# Altium schematic sheet 02_Boost_Converter.SchDoc
size A2
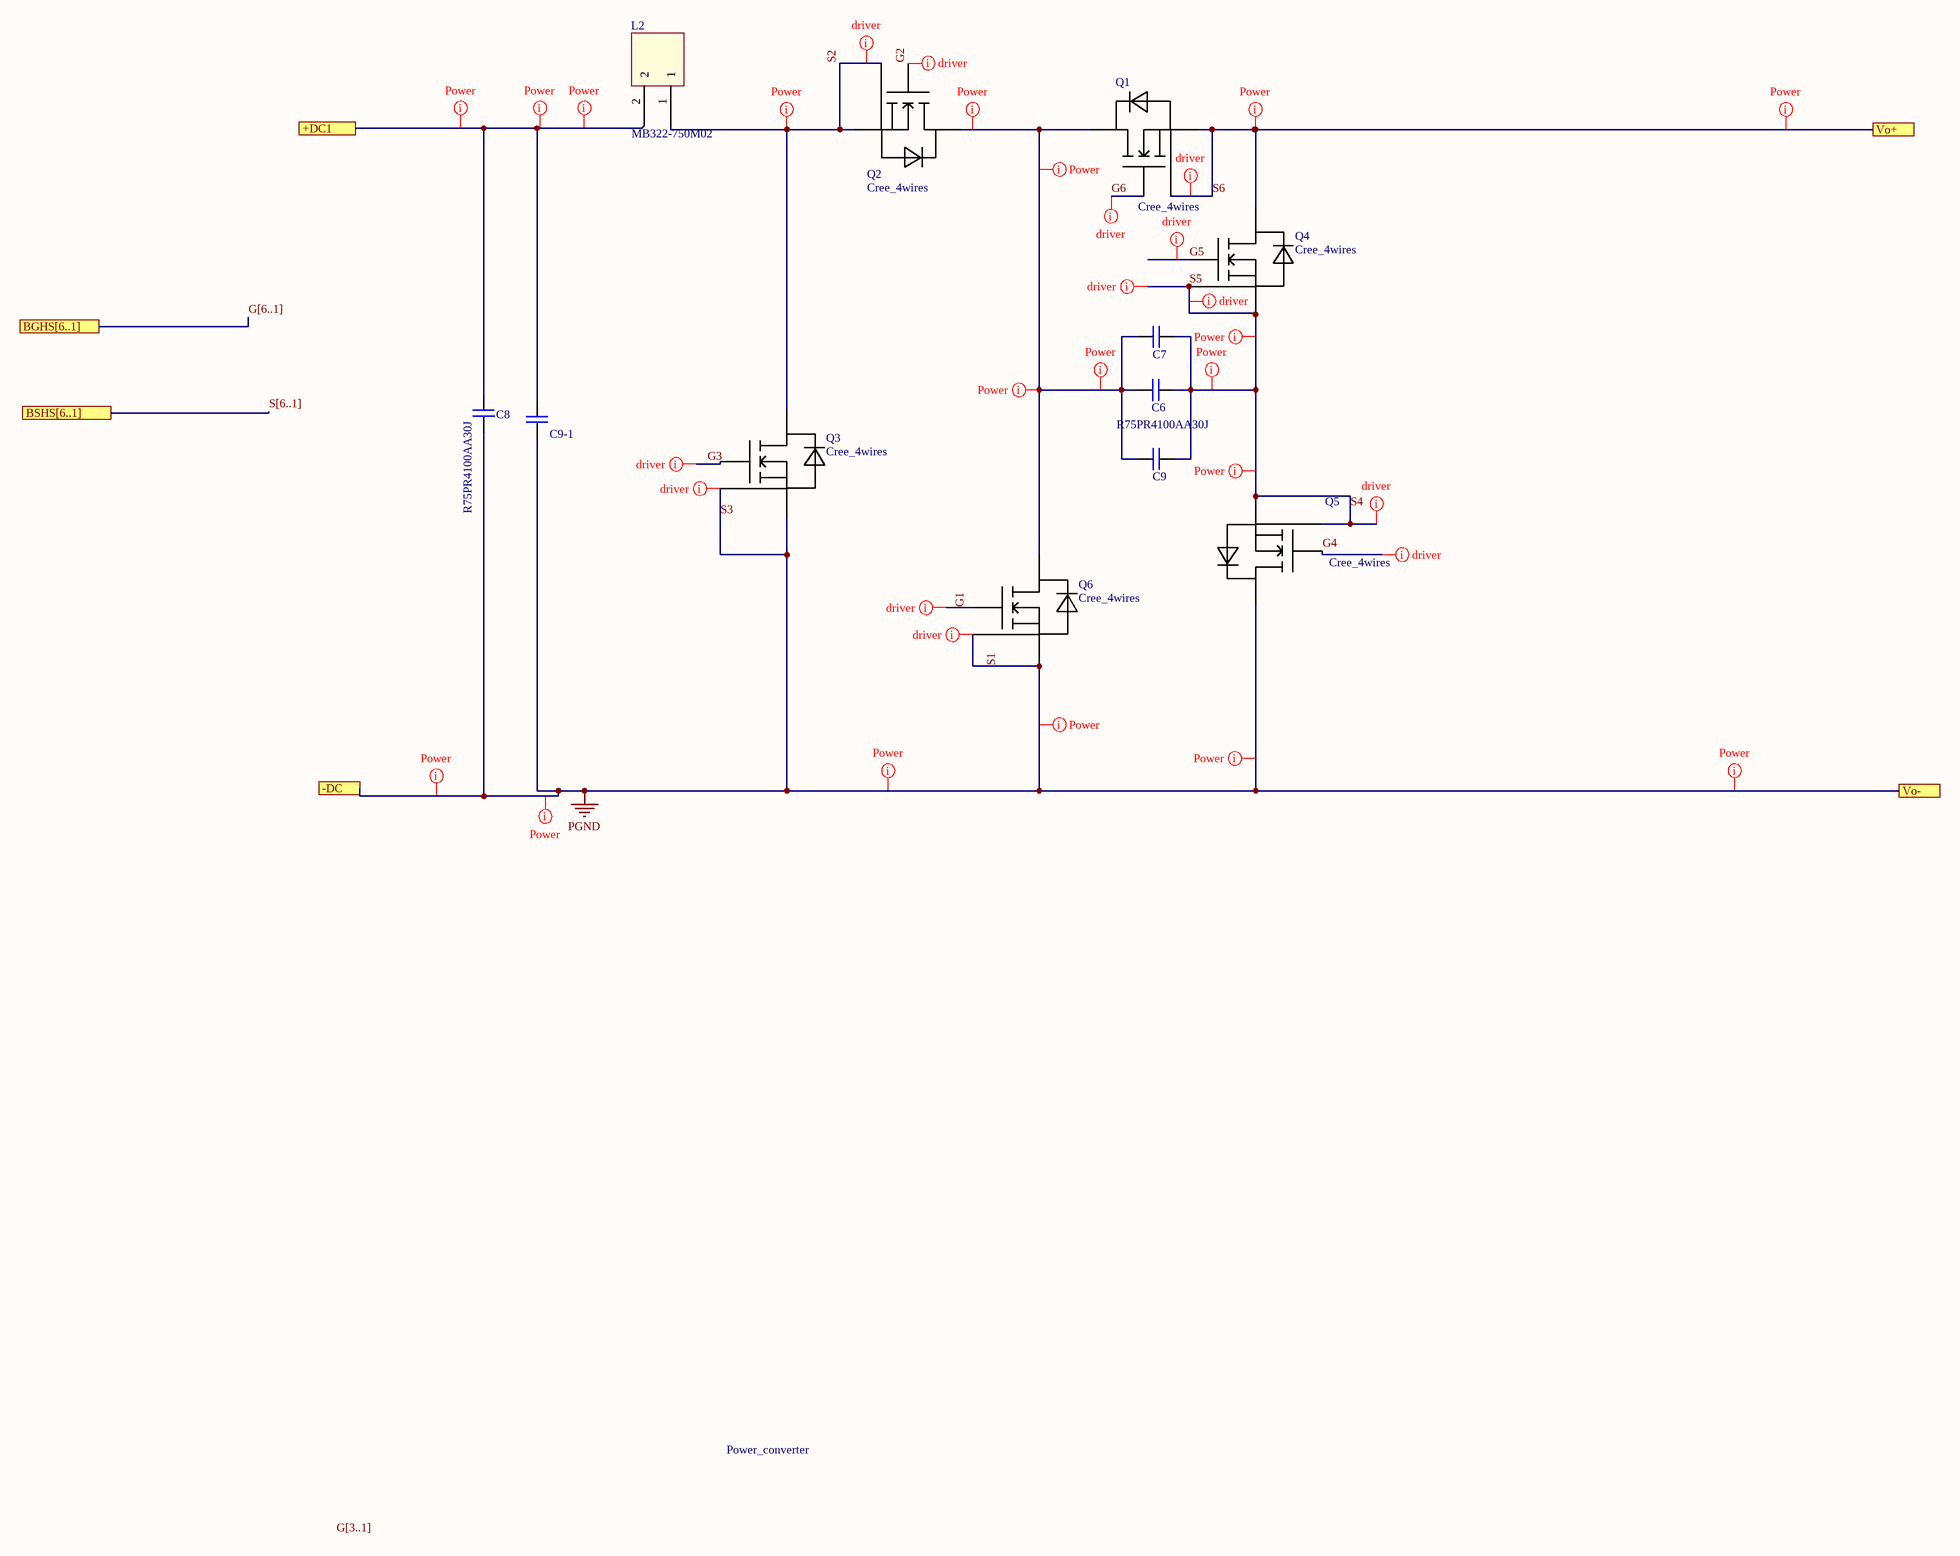
[diagram p0: 02_Boost_Converter.SchDoc]

## Parts
C6  R75PR4100AA30J  [CAP_6]
C7  C_ceram_HV  [CAP_250V]  (value not drawn)
C8  R75PR4100AA30J  [32x22]
C9  C_ceram_HV  [CAP_250V]  (value not drawn)
C9-1  C_ceram_HV  [C_ceram_HV]  (value not drawn)
L2  MB322-750M02  [2_HOLES_7.5]
Q1  Cree_4wires  [VT4_SicMosfet]
Q2  Cree_4wires  [VT4_SicMosfet]
Q3  Cree_4wires  [VT4_SicMosfet]
Q4  Cree_4wires  [VT4_SicMosfet]
Q5  Cree_4wires  [VT4_SicMosfet]
Q6  Cree_4wires  [VT4_SicMosfet]

## Ports
+DC1, -DC, BGHS[6..1], BSHS[6..1], Vo+, Vo-

## Nets
S1: C8.2 C9-1.2 Q3.2(S) Q3.3(SG) Q5.1(D) Q6.2(S) Q6.3(SG) ; port Vo-, port -DC  [also labelled PGND, S3]
+DC1: C8.1 C9-1.1 L2.2 ; port +DC1
G1: Q6.4(G)
G2: Q2.4(G)
G3: Q3.4(G)
G4: Q5.4(G)
G5: Q4.4(G)
G6: Q1.4(G)
S2: L2.1 Q2.2(S) Q2.3(SG) Q3.1(D)
S4: C6.2 C7.2 C9.2 Q4.2(S) Q4.3(SG) Q5.2(S) Q5.3(SG)  [also labelled S5]
S6: Q1.2(S) Q1.3(SG) Q4.1(D) ; port Vo+
NetC6_1: C6.1 C7.1 C9.1 Q1.1(D) Q2.1(D) Q6.1(D)

## Buses and harness runs
bus G[3..1]
bus G[6..1] = port BGHS[6..1]
bus S[6..1] = port BSHS[6..1]

## Layout directives
net class Power: (no net found under the mark), +DC1, NetC6_1, S1, S2, S4, S6
net class Driver: G1, G2, G3, G4, G5, G6, S1, S2, S4, S6

## Notes on the sheet
- Power_converter
- Labels drawn without touching a wire or pin: G[3..1]

## Library data of the parts
C6 = C_ceram_HV
L2 = MB322-750M02: Value: 2 poles, 16A, 750V; Order code: 48-397-07; Type: MB322-750M02; Manufacturer: *; Supplier: Elfa; Package: 7.5 mm; Price: 0.43